# Altium schematic sheet QEP.SchDoc
size A4
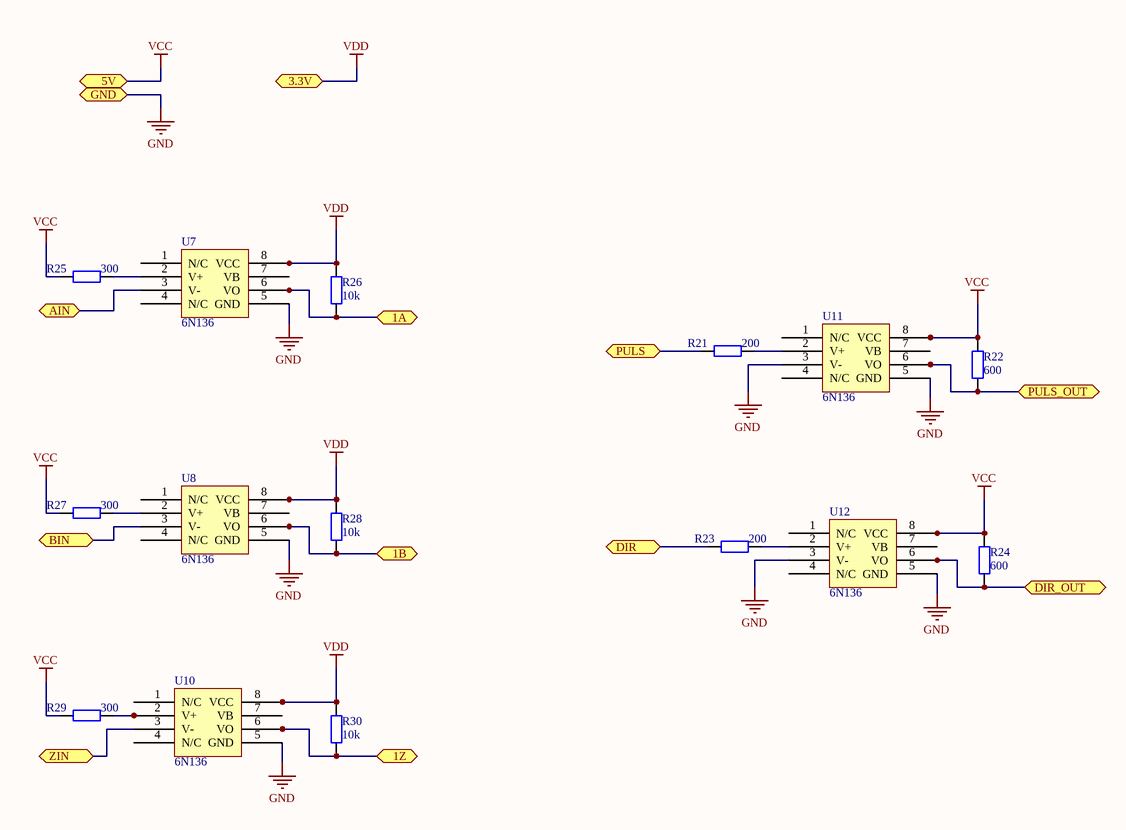
[diagram p0: QEP.SchDoc]

## Parts
R21  value 200  [0805]  (hidden comment: RES)
R22  value 600  [0805]  (hidden comment: RES)
R23  value 200  [0805]  (hidden comment: RES)
R24  value 600  [0805]  (hidden comment: RES)
R25  value 300  [0805]  (hidden comment: RES)
R26  value 10k  [0805]  (hidden comment: RES)
R27  value 300  [0805]  (hidden comment: RES)
R28  value 10k  [0805]  (hidden comment: RES)
R29  value 300  [0805]  (hidden comment: RES)
R30  value 10k  [0805]  (hidden comment: RES)
U7  6N136  [SOP8]
U8  6N136  [SOP8]
U10  6N136  [SOP8]
U11  6N136  [SOP8]
U12  6N136  [SOP8]

## Ports
1A, 1B, 1Z, 3.3V, 5V, AIN, BIN, DIR, DIR_OUT, GND, PULS, PULS_OUT, ZIN

## Nets
GND: U7.5(GND) U8.5(GND) U10.5(GND) U11.3(V-) U11.5(GND) U12.3(V-) U12.5(GND) ; port GND
VCC: R22.2 R24.2 R25.1 R27.1 R29.1 U11.8(VCC) U12.8(VCC) ; port 5V
VDD: R26.2 R28.2 R30.2 U7.8(VCC) U8.8(VCC) U10.8(VCC) ; port 3.3V
1A: R26.1 U7.6(VO) ; port 1A
1B: R28.1 U8.6(VO) ; port 1B
1Z: R30.1 U10.6(VO) ; port 1Z
AIN: U7.3(V-) ; port AIN
BIN: U8.3(V-) ; port BIN
DIR: R23.1 ; port DIR
DIR_OUT: R24.1 U12.6(VO) ; port DIR_OUT
PULS: R21.1 ; port PULS
PULS_OUT: R22.1 U11.6(VO) ; port PULS_OUT
ZIN: U10.3(V-) ; port ZIN
NetR21_2: R21.2 U11.2(V+)
NetR23_2: R23.2 U12.2(V+)
NetR25_2: R25.2 U7.2(V+)
NetR27_2: R27.2 U8.2(V+)
NetR29_2: R29.2 U10.2(V+)

Not connected (* = marked no-connect by the designer): U7 1(N/C) 4(N/C) 7(VB); U8 1(N/C) 4(N/C) 7(VB); U10 1(N/C) 4(N/C) 7(VB); U11 1(N/C) 4(N/C) 7(VB); U12 1(N/C) 4(N/C) 7(VB)

## Library data of the parts
U7 U8 U10-U12 = Component_1